# EasyEDA Pro project LeTian-robot2（轮腿机器人）.eprj, board 4010motor-PCB
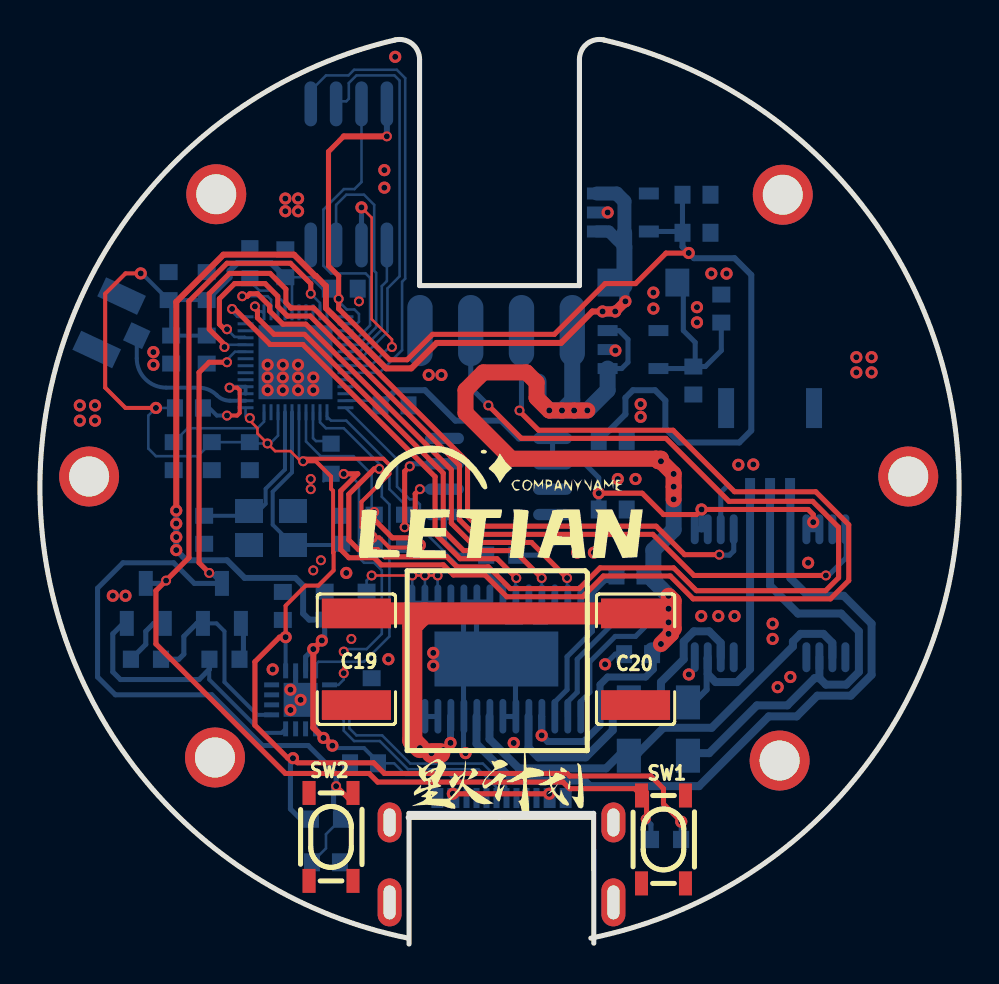
[diagram p10: board, top side]
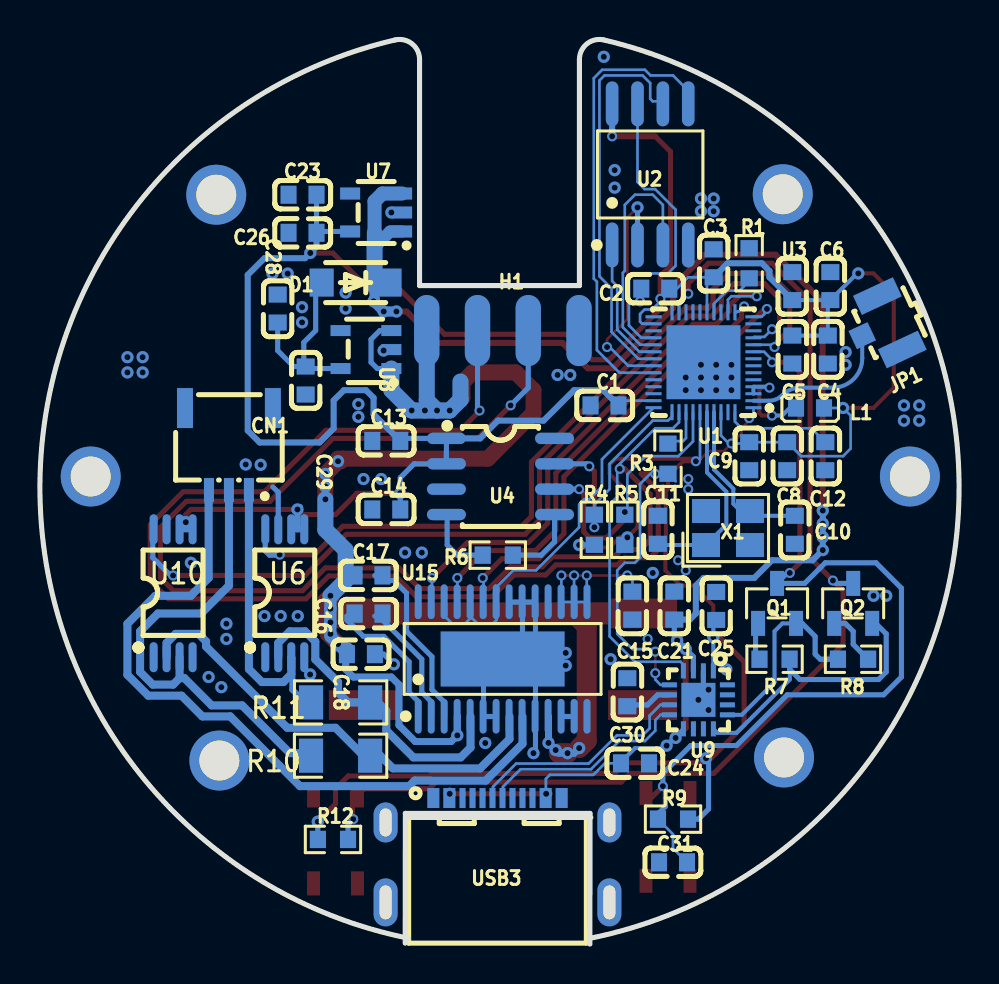
[diagram p11: board, bottom side, seen from below]

Outline 45.99 x 45.23 mm; copper layers: Top Layer, Bottom Layer. Coordinates in mm from the lower left corner of the outline.
Outline path: 18.43,0.29 arc(0,22.5) 17.77,45.23 arc(18.62,45.04) 19,44.26 19,32.94 27,32.94 27,44.26 arc(27.38,45.04) 28.22,45.23 arc(45.99,22.5) 27.57,0.29 ; 18.43,6.33 27.57,6.33
Stack: Top Layer 0.035mm / Dielectric1 1.51mm FR4 er 4.5 / Bottom Layer 0.035mm

## Design rules (mm)
spacing safeClearance (default): track to track 0.152, other pairs 0.152 to 0.3
track width trackWidth (default): min 0.127, default 0.254, max 2.54
differential pair differentialPair (default): width min 0.127, default 0.254, max 2.54; gap min 0.152, default 0.152
via viaSize (default): diameter min 0.5, default 0.61, max 10; hole min 0.3, default 0.305, max 6

## Placement (name value [footprint] x y rotation side)
C1  0.1uF  [C0603]  17.74 26.95 0 bottom
C2  1uF  [C0603]  15.2 32.79 0 bottom
C3  0.1uF  [C0603]  12.28 34.06 270 bottom
C4  0.1uF  [C0603]  6.57 29.74 270 bottom
C5  0.1uF  [C0603]  8.34 29.74 270 bottom
C6  1uF  [C0603]  6.44 32.92 90 bottom
C8  100pF  [C0603]  8.6 24.41 270 bottom
C9  1uF  [C0603]  10.5 24.41 270 bottom
C10  10pF  [C0603]  8.22 20.73 90 bottom
C11  10pF  [C0603]  15.07 20.73 270 bottom
C12  10nF  [C0603]  6.69 24.41 270 bottom
C13  0.1uF  [C0603]  28.66 25.17 180 bottom
C14  1uF  [C0603]  28.66 21.74 180 bottom
C15  0.47uF  [C0603]  16.34 16.93 90 bottom
C16  10nF  [C0603]  29.55 16.53 0 bottom
C17  0.1uF  [C0603]  29.55 18.44 180 bottom
C18  0.1uF  [C0603]  29.93 14.5 0 bottom
C19  47uF  [C1812]  15.84 14.25 90 top
C20  47uF  [C1812]  29.81 14.25 90 top
C21  1uF  [C0603]  14.25 16.93 90 bottom
C23  0.1uF  [C0603]  32.85 37.49 0 bottom
C24  0.1uF  [C0603]  16.22 9.04 180 bottom
C25  0.1uF  [C0603]  12.15 16.92 270 bottom
C26  10uF  [C0603]  32.85 35.58 0 bottom
C28  0.1uF  [C0603]  34.1 31.79 90 bottom
C29  10uF  [C0603]  32.7 28.19 270 bottom
C30  0.1uF  [C0603]  16.6 12.6 270 bottom
C31  0.1uF  [C0603]  14.31 4.09 180 bottom
CN1  HDGC1002WR-S-3P  [CONN-SMD_3P-P1.00_HDGC_HDGC1002WR-S-3P]  36.54 24.76 0 bottom
D1  K24  [SOD-123FL_L2.8-W1.9-LS3.7-RD]  30.2 33.09 0 bottom
H1  -  [排针 4P]  22.83 30.63 180 bottom
JP1  U.FL-R-SMT-1(80)  [RF-SMD_FRF05002-JSS103M]  4.15 30.76 245 bottom
L1  2nH  [L0603]  7.45 26.82 0 bottom
NOREF  -  [Pad_e1]  2.46 23.39 0 top
NOREF#2  -  [Pad_e4]  37.02 9.18 0 top
NOREF#3  -  [Pad_e0]  43.46 23.39 0 top
NOREF#4  -  [Pad_e5]  8.76 9.33 0 top
NOREF#5  -  [Pad_e3]  37.17 37.49 0 top
NOREF#6  -  [Pad_e2]  8.82 37.51 0 top
Q1  SS8050  [SOT-23-3_L2.9-W1.3-P1.90-LS2.4-BR]  9.11 17.04 270 bottom
Q2  SS8050  [SOT-23-3_L2.9-W1.3-P1.90-LS2.4-BR]  5.3 17.04 270 bottom
R1  10k  [R0603]  10.5 34.06 270 bottom
R3  499  [R0603]  14.57 24.28 270 bottom
R4  10k  [R0603]  18.25 20.73 270 bottom
R5  10k  [R0603]  16.73 20.73 270 bottom
R6  1k  [R0603]  23.08 19.46 0 bottom
R7  10K  [R0603]  9.23 14.25 0 bottom
R8  10K  [R0603]  5.3 14.25 180 bottom
R9  10k  [R0603]  14.31 6.25 180 bottom
R10  0.005  [R1206]  30.95 9.42 180 bottom
R11  0.005  [R1206]  30.95 12.09 180 bottom
R12  10k  [R0603]  31.33 5.23 0 bottom
SW1  -  [KEY-SMD_4P-L4.2-W3.2-P2.20-LS5.1-TL]  31.2 5.23 90 top
SW2  -  [KEY-SMD_4P-L4.2-W3.2-P2.20-LS5.1-TL]  14.57 5.36 90 top
U1  -  [QFN-48_L5.0-W5.0-P0.35-BL-EP3.7]  12.79 29.11 90 bottom
U2  W25Q80DVSSIG  [SOIC-8_L5.3-W5.3-P1.27-LS8.0-BL]  15.46 38.51 180 bottom
U3  10uF  [C0603]  8.34 32.92 90 bottom
U4  AS5600-ASOT  [SOIC-8_L5.0-W4.0-P1.27-LS6.0-BL]  22.95 23.39 270 bottom
U6  INA240A3PWR  [TSSOP-8_L4.4-W3.0-P0.65-LS6.4-BL-2]  33.74 17.55 180 bottom
U7  SPX3819M5-L-3-3/TR  [SOT-23-5_L3.0-W1.7-P0.95-LS2.8-BR]  29.17 36.6 180 bottom
U8  SPX3819M5-L-5-0/TR  [SOT-23-5_L3.0-W1.7-P0.95-LS2.8-TL]  29.68 29.74 0 bottom
U9  CH343P  [TQFN-16_L3.0-W3.0-P0.50-BL-EP1.7]  13.04 12.22 0 bottom
U10  INA240A3PWR  [TSSOP-8_L4.4-W3.0-P0.65-LS6.4-BL-2]  39.33 17.55 180 bottom
U15  DRV8313PWPR  [HTSSOP-28_L9.8-W4.5-P0.65-LS6.6-BL-EP]  22.84 14.26 180 bottom
USB3  TYPE-C 16P CB0.8 073  [USB-C-SMD_TYPE-C-16P-CB0.8-073]  23.1 4.69 180 bottom
X1  -  [CRYSTAL-SMD_4P-L3.2-W2.5-BL]  11.56 20.81 180 bottom

## Footprints (pads in the part's own frame, mm; a bottom-side part is the same pattern mirrored in y, then rotated)
C0603
  rect 0.8x0.9 smd: 1(-0.7,0) 2(0.7,0)
C1812
  rect 1.486x3.457 smd: 1(-2.293,0) 2(2.293,0)
CONN-SMD_3P-P1.00_HDGC_HDGC1002WR-S-3P
  rect 0.5x1.2 smd: 1(-1,2.05) 2(0,2.05) 3(1,2.05)
  rect 0.8x2 smd: 4(2.2,-2.05) 5(-2.2,-2.05)
CRYSTAL-SMD_4P-L3.2-W2.5-BL
  rect 1.4x1.2 smd: 1(-1.1,-0.85) 2(1.1,-0.85) 3(1.1,0.85) 4(-1.1,0.85)
HTSSOP-28_L9.8-W4.5-P0.65-LS6.6-BL-EP
  oval 0.343x1.732 smd: 1(-4.224,-2.865) 2(-3.574,-2.865) 3(-2.926,-2.865) 4(-2.276,-2.865) 5(-1.625,-2.865) 6(-0.976,-2.865) 7(-0.325,-2.865) 8(0.325,-2.865) 9(0.976,-2.865) 10(1.625,-2.865) 11(2.276,-2.865) 12(2.926,-2.865) 13(3.576,-2.865) 14(4.224,-2.865) 15(4.224,2.865) 16(3.576,2.865) 17(2.926,2.865) 18(2.276,2.865) 19(1.625,2.865) 20(0.976,2.865) 21(0.325,2.865) 22(-0.325,2.865) 23(-0.976,2.865) 24(-1.625,2.865) 25(-2.276,2.865) 26(-2.926,2.865) 27(-3.574,2.865) 28(-4.224,2.865)
  rect 6.2x2.751 smd: 29(0,0)
KEY-SMD_4P-L4.2-W3.2-P2.20-LS5.1-TL
  rect 1.199x0.65 smd: 1(-2.2,1.1) 2(2.2,1.1) 3(-2.2,-1.1) 4(2.2,-1.1)
L0603
  rect 0.8x0.864 smd: 1(-0.7,0) 2(0.7,0)
Pad_e0
  round 3 hole 2: 1(0,0)
Pad_e1
  round 3 hole 2: 1(0,0)
Pad_e2
  round 3 hole 2: 1(0,0)
Pad_e3
  round 3 hole 2: 1(0,0)
Pad_e4
  round 3 hole 2: 1(0,0)
Pad_e5
  round 3 hole 2: 1(0,0)
QFN-48_L5.0-W5.0-P0.35-BL-EP3.7
  rect 0.15x0.8 smd: 1(-2.275,-2.5) 2(-1.925,-2.5) 3(-1.575,-2.5) 4(-1.225,-2.5) 5(-0.875,-2.5) 6(-0.525,-2.5) 7(-0.175,-2.5) 8(0.175,-2.5) 9(0.525,-2.5) 10(0.875,-2.5) 11(1.225,-2.5) 12(1.575,-2.5) 13(1.925,-2.5) 14(2.275,-2.5) 25(2.275,2.5) 26(1.925,2.5) 27(1.575,2.5) 28(1.225,2.5) 29(0.875,2.5) 30(0.525,2.5) 31(0.175,2.5) 32(-0.175,2.5) 33(-0.525,2.5) 34(-0.875,2.5) 35(-1.225,2.5) 36(-1.575,2.5) 37(-1.925,2.5) 38(-2.275,2.5)
  rect 0.8x0.15 smd: 15(2.5,-1.575) 16(2.5,-1.225) 17(2.5,-0.875) 18(2.5,-0.525) 19(2.5,-0.175) 20(2.5,0.175) 21(2.5,0.525) 22(2.5,0.875) 23(2.5,1.225) 24(2.5,1.575) 39(-2.5,1.575) 40(-2.5,1.225) 41(-2.5,0.875) 42(-2.5,0.525) 43(-2.5,0.175) 44(-2.5,-0.175) 45(-2.5,-0.525) 46(-2.5,-0.875) 47(-2.5,-1.225) 48(-2.5,-1.575)
  rect 3.7x3.7 smd: 49(0.001,0)
R0603
  rect 0.806x0.864 smd: 1(-0.753,0) 2(0.753,0)
R1206
  rect 1.208x1.701 smd: 1(-1.479,0) 2(1.479,0)
RF-SMD_FRF05002-JSS103M
  rect 1x1.05 smd: 1(0,-0.762)
  rect 1.05x2.2 smd: 2(-1.475,0.762) 3(1.475,0.762)
SOD-123FL_L2.8-W1.9-LS3.7-RD
  rect 1.199x1.399 smd: 1(-1.7,0) 2(1.7,0)
SOIC-8_L5.0-W4.0-P1.27-LS6.0-BL
  oval 0.569x1.95 smd: 1(-1.905,-2.705) 2(-0.635,-2.705) 3(0.635,-2.705) 4(1.905,-2.705) 5(1.905,2.705) 6(0.635,2.705) 7(-0.635,2.705) 8(-1.905,2.705)
SOIC-8_L5.3-W5.3-P1.27-LS8.0-BL
  oval 0.63x2.25 smd: 1(-1.905,-3.53) 2(-0.635,-3.53) 3(0.635,-3.53) 4(1.905,-3.53) 5(1.905,3.53) 6(0.635,3.53) 7(-0.635,3.53) 8(-1.905,3.53)
SOT-23-3_L2.9-W1.3-P1.90-LS2.4-BR
  rect 1.25x0.7 smd: 1(1,-0.95) 2(1,0.95) 3(-1,0)
SOT-23-5_L3.0-W1.7-P0.95-LS2.8-BR
  rect 1x0.6 smd: 1(1.3,-0.95) 2(1.3,0) 3(1.3,0.95) 4(-1.3,0.95) 5(-1.3,-0.95)
SOT-23-5_L3.0-W1.7-P0.95-LS2.8-TL
  rect 1x0.55 smd: 1(-1.272,0.95) 2(-1.272,0) 3(-1.272,-0.95) 4(1.272,-0.95) 5(1.272,0.95)
TQFN-16_L3.0-W3.0-P0.50-BL-EP1.7
  rect 0.25x0.75 smd: 1(-0.749,-1.45) 2(-0.248,-1.45) 3(0.252,-1.45) 4(0.751,-1.45) 9(0.75,1.45) 10(0.25,1.45) 11(-0.25,1.45) 12(-0.749,1.45)
  rect 0.75x0.25 smd: 5(1.45,-0.75) 6(1.45,-0.25) 7(1.45,0.25) 8(1.45,0.75) 13(-1.45,0.75) 14(-1.45,0.25) 15(-1.45,-0.25) 16(-1.45,-0.75)
  rect 1.7x1.7 smd: 17(0.001,0)
TSSOP-8_L4.4-W3.0-P0.65-LS6.4-BL-2
  oval 0.4x1.5 smd: 1(-0.975,-3.2) 2(-0.325,-3.2) 3(0.325,-3.2) 4(0.976,-3.2) 5(0.976,3.2) 6(0.325,3.2) 7(-0.325,3.2) 8(-0.975,3.2)
USB-C-SMD_TYPE-C-16P-CB0.8-073
  oval 1.2x2.4 hole 0.6x1.7: 0(-5.6,-2.611) 0(5.6,-2.611)
  oval 1.2x2 hole 0.6x1.4: 0(-5.6,1.389) 0(5.6,1.389)
  rect 0.6x1 smd: A1B12(-3.21,2.611) A4B9(-2.41,2.611) B1A12(3.21,2.611) B4A9(2.41,2.611)
  rect 0.3x1 smd: A5(-1.25,2.611) A6(-0.25,2.611) A7(0.251,2.61) A8(1.25,2.611) B5(1.75,2.611) B6(0.75,2.611) B7(-0.75,2.61) B8(-1.75,2.611)
排针 4P
  oval 1.27x3.561 smd: 1(-3.81,0.064) 2(-1.27,0.064) 3(1.27,0.064) 4(3.81,0.064)

## Nets
3V3: C1.1 C2.1 C3.2 C4.1 C5.1 C6.1 C8.1 C9.1 C13.2 C14.2 C23.1 C25.2 C26.1 L1.1 R4.2 R5.2 R9.2 R12.2 U1.1 U1.19 U1.26 U1.37 U1.43 U1.46 U2.8 U3.1 U4.1 U4.2 U6.5 U6.6 U7.5 U9.1 U10.5 U10.6
5V: C21.1 C24.1 D1.1 U7.1 U7.3 U9.3 U9.9 USB3.A4B9 USB3.B4A9
5V_IN: C28.1 C29.1 D1.2 U8.5
GND: C1.2 C2.2 C3.1 C4.2 C5.2 C6.2 C8.2 C9.2 C10.1 C11.1 C12.2 C13.1 C14.1 C15.1 C18.1 C19.1 C20.1 C21.2 C23.2 C24.2 C25.1 C26.2 C28.2 C29.2 C30.1 C31.1 CN1.4 CN1.5 H1.4 JP1.2 JP1.3 NOREF.1 NOREF#2.1 NOREF#3.1 NOREF#4.1 NOREF#5.1 NOREF#6.1 R1.1 R6.2 SW1.3 SW2.1 U1.49 U2.4 U3.2 U4.4 U4.8 U6.4 U6.7 U7.2 U8.2 U9.2 U9.17 U10.4 U10.7 U15.6 U15.7 U15.10 U15.12 U15.13 U15.14 U15.19 U15.20 U15.21 U15.28 U15.29 USB3.0 USB3.A1B12 USB3.B1A12 X1.2 X1.4
VCC: C17.1 C18.2 C19.2 C20.2 H1.1 U8.1 U8.3 U15.4 U15.11
DTR: Q2.2 R7.1 U9.12
EN: C31.2 Q1.3 R9.1 SW2.4 U1.9
GPIO0: Q2.3 R12.1 SW1.2 U1.23
ISEN_U: U1.10 U6.8
ISEN_V: U1.11 U10.8
M_EN: U1.38 U15.22 U15.24 U15.26
PWM1: U1.16 U15.27
PWM2: U1.15 U15.25
PWM3: U1.14 U15.23
RTS: Q1.2 R8.1 U9.13
RXD: H1.2 R3.2 U9.5
SCK/CLK: U1.31 U2.6
SCL: R4.1 U1.39 U4.7
SCS/CMD: U1.30 U2.1
SDA: R5.1 U1.42 U4.6
SDI/SD1: U1.33 U2.5
SDO/SD0: U1.32 U2.2
SHD/SD2: U1.28 U2.7
SWP/SD3: U1.29 U2.3
TXD: H1.3 U1.40 U9.4
U-I: R11.2 U6.2 U15.5
U-O: CN1.1 R11.1 U6.3
UD+: U9.7 USB3.A6
UD-: U9.8 USB3.A7
V-I: R10.2 U10.2 U15.8
V-O: CN1.2 R10.1 U10.3
W: CN1.3 U15.9
$1N20049: R1.2 U1.18
$1N20884: L1.2 U1.3 U1.4
$1N22670: C10.2 U1.45 X1.3
$1N22706: C11.2 U1.44 X1.1
$1N23281: C12.1 U1.48
$1N23445: R3.1 U1.41
$1N23827: JP1.1 U1.2
$1N25852: R6.1 U4.5
$1N27382: C15.2 U15.15 U15.16 U15.17
$1N28418: C16.2 U15.1
$1N28444: C16.1 U15.2
$1N28632: C17.2 U15.3
$1N46692: C30.2 U9.6
$1N51311: Q2.1 R8.2
$1N51359: Q1.1 R7.2

Pads without a net: SW1 1 4; SW2 2 3; U1 5 6 7 8 12 13 17 20 21 22 24 25 27 34 35 36 47; U4 3; U6 1; U7 4; U8 4; U9 10 11 14 15 16; U10 1; U15 18; USB3 A5 A8 B5 B6 B7 B8

## Via types
v1: diameter 0.61, hole 0.305, Top Layer to Bottom Layer, 111 vias
v2: diameter 0.5, hole 0.3, Top Layer to Bottom Layer, 44 vias

## Routing (per net, layer and track width the routed paths; a pad name or vN(x,y) marks a point on that pad's centre or on a via; arc(x,y) is an arc through that point)
3V3: length 203.4
  Top Layer w0.13: v2(10.5,26.31) 10.5,26.19 10.88,25.81 10.88,25.55 v2(11.39,25.04) 11.77,24.66 12.53,24.66 13.04,24.15
  Top Layer w0.2: v1(5.8,26.82) 4.28,26.82 3.26,27.84 3.26,32.54 4.28,33.55 v1(5.04,33.55) ; v2(13.17,24.15) 13.8,24.15 14.57,23.39 14.57,22.78 14.67,22.67 14.67,19.58 14.69,19.6 14.69,18.69 13.93,17.93 13.3,17.93 12.29,16.93 v1(12.29,15.35) ; v2(13.17,24.15) 13.3,24.28 17.18,24.28 17.49,23.98 17.49,23.52 16.09,22.12 16.09,20.85 v1(16.6,20.34) 16.98,20.34 17.49,19.84 18.88,19.84 v1(19.01,19.96) ; v2(13.17,24.15) 13.04,24.15
  Top Layer w0.254: v1(12.29,15.35) 11.99,15.35 10.76,14.12 10.76,10.95 12.41,9.3 v1(12.66,9.3) 12.89,9.07 16.7,9.07 17.23,8.53 26.38,8.53 26.5,8.41 30.57,8.41 31.2,7.77 31.2,7.01 v1(32.09,6.12) ; 15.2,40.41 14.44,39.65 14.44,33.93 14.95,33.43 v2(14.95,32.28) 14.95,31.79 17.5,29.23 18.38,29.23 19.65,30.5 25.74,30.5 28.28,33.04 29.81,33.04 31.33,34.57 32.46,34.57 v1(32.47,34.58) ; v1(27.96,22.55) 30.14,22.55 31.2,21.49 32.85,21.49 v1(33.11,21.74) 38.44,21.74 38.7,21.49 v1(38.7,21.11)
  Top Layer w0.3: 15.2,40.41 v2(17.36,40.41)
  Bottom Layer w0.13: U1.1 10.29,26.4 10.38,26.31 v2(10.5,26.31) ; 12.53,33.36 C3.2 ; 12.53,33.36 12.61,33.28 U1.19 ; 12.53,33.36 13.55,33.36 14.25,32.66 14.57,32.66 14.82,32.41 14.82,32.28 v2(14.95,32.28) 14.95,32.16 15.36,31.75 15.74,31.75 15.96,31.52 15.96,31.14 15.86,31.03 U1.26 ; U1.46 11.91,25.44 11.52,25.04 10.57,25.04 C9.1 C8.1 7.9,24.41 5.8,24.41 5.42,24.79 5.42,26.44 v1(5.8,26.82) L1.1 ; U1.43 12.96,24.23 13.04,24.15 v2(13.17,24.15) ; U1.37 16.81,27.18 C1.1
  Bottom Layer w0.2: U9.1 v1(12.29,15.35) 12.29,16.08 C25.2 ; 8.47,32.22 U3.1 6.57,32.22 6.57,30.57 6.69,30.44 8.47,30.44 ; C6.1 5.1,33.55 v1(5.04,33.55)
  Bottom Layer w0.254: v1(32.09,6.12) 32.09,5.24 R12.2 ; C13.2 27.84,25.3 U4.1 U4.2 27.27,24.03 27.96,23.33 v1(27.96,22.55) C14.2 ; v1(19.01,19.96) 19,19.97 R4.2 ; U7.5 32.09,35.65 C26.1 C23.1 ; v1(12.66,9.3) 12.53,9.17 12.53,6.76 13.04,6.25 R9.2
  Bottom Layer w0.3: 33.11,20.75 U6.5 ; 33.11,20.75 U6.6 ; 33.11,20.75 v1(33.11,21.74) 32.98,21.87 ; U4.1 23.96,25.3 23.08,26.19 20.79,26.19 19.27,27.71 17.8,27.71 C1.1 ; U10.6 U10.5 ; C26.1 32.15,34.89 v1(32.47,34.58) 32.73,34.31 34.76,34.31 35.6,33.48 35.6,25.69 35,25.09 32,25.09 31.3,25.79 31.3,27.19 30.78,27.71 29.68,27.71 29.3,27.33 29.3,26.51 C13.2 ; U3.1 9.49,33.36 9.49,33.68 9.87,34.06 11.58,34.06 C3.2 ; U2.8 v2(17.36,40.41)
5V: length 82.4
  Top Layer w0.254: v1(25.49,7.52) v1(20.66,7.52)
  Top Layer w0.3: v1(14.63,9.92) 14.25,10.31 v1(14.19,10.31) 13.68,10.82 v1(13.68,14.76) v1(14.11,15.19) ; v1(28.16,31.65) 27.65,31.65 26.08,30.08 19.85,30.08 18.58,28.81 17.32,28.81 14.31,31.81 14.31,32.92 13.8,33.43 13.78,33.43 12.71,34.49 9.18,34.49 6.82,32.13 v1(6.82,21.69)
  Top Layer w0.5: v1(28.16,31.65) v1(28.79,31.65) v1(29.3,32.16)
  Bottom Layer w0.13: C24.1 17.72,9.04 18.3,8.46 20.48,8.46 20.68,8.27 20.68,7.52 ; 20.68,7.52 20.66,7.42 20.68,7.4 20.68,7.52
  Bottom Layer w0.2: U9.9 14.19,10.37 v1(14.19,10.31) 14.25,10.31 14.76,9.8 16.22,9.8 16.92,9.1 C24.1
  Bottom Layer w0.254: U9.3 13.29,14.37 v1(13.68,14.76) 14.25,15.33 14.25,16.23
  Bottom Layer w0.3: v1(6.82,21.69) v1(6.82,21.04) v1(6.82,20.36) v1(6.82,19.71) 7.33,19.2 9.36,19.2 10.24,18.32 12.78,18.32 13.17,17.93 13.17,16.53 13.47,16.23 14.25,16.23
  Bottom Layer w0.5: 29.25,32.11 v1(28.79,31.65) v1(28.16,31.65) ; 29.25,32.11 v1(29.3,32.16) 29.3,32.23 29.25,32.28 ; 29.25,32.11 29.25,32.28 ; 29.25,32.28 29.25,32.92
  Bottom Layer w0.6: 29.25,34.87 28.47,35.65 U7.1
  Bottom Layer w0.7: U7.3 28.86,37.55 29.25,37.16 29.25,35.58
  Bottom Layer w0.77: 29.25,34.87 29.25,35.58
  Bottom Layer w0.8: 29.25,34.87 29.25,32.92
5V_IN: length 9.6
  Bottom Layer w0.254: C28.1 34.1,29.69 33.3,28.89 32.79,28.89 ; 32.79,28.89 C29.1 ; 32.79,28.89 32.79,28.85 32.73,28.79 U8.5 ; 32.79,28.89 32.79,30.1 32.2,30.69 32.2,32.79 D1.2
GND: length 19.4
  Bottom Layer w0.254: U4.4 25.62,21.45 25.62,19.96 25.11,19.46 R6.2 ; 21.85,17.11 21.85,15.22 ; 21.85,17.11 22.5,17.11 ; 21.85,17.11 21.2,17.11 21.2,15.68 ; v1(12.53,12.72) 12.79,12.98 U9.2 ; U6.7 34.07,22.6 34.34,22.87 ; v1(21.3,9.55) 21.2,9.65 21.2,13.13 ; 29.23,14.5 28.79,14.5 v1(28.28,13.99) ; 23.8,13.27 23.8,11.38 23.15,11.38 ; 19.25,11.38 19.9,11.38
  vias: v1(1.99,26.95) v1(1.99,26.19) v1(2.76,26.95) v1(2.76,26.19) v1(3.64,17.42) v1(4.28,17.42) v1(5.68,29.62) v1(5.68,28.98) v1(11.39,28.98) v1(11.39,28.35) v1(11.39,27.71) v1(11.65,13.74) v1(12.15,28.98) v1(12.15,28.35) v1(12.15,27.71) v1(12.28,37.3) v1(12.28,36.66) v1(12.53,11.71) v1(12.92,37.3) v1(12.92,36.66) v1(12.92,28.98) v1(12.92,28.35) v1(12.92,27.71) v1(13.04,12.22) v1(13.68,28.35) v1(13.68,27.71) v1(15.33,18.57) v1(17.23,38.72) v1(17.23,37.84) v1(17.44,14.25) v1(17.78,44.39) v1(19.46,28.47) v1(19.68,14.57) v1(19.68,13.93) v1(20.09,28.47) v1(23.71,10.06) v1(26.89,19.58) v1(27.72,19.58) v1(28.41,36.6) v1(28.8,29.69) v1(28.92,23.27) v1(29.8,23.27) v1(30.06,27.01) v1(30.06,26.38) v1(30.7,32.59) v1(30.7,31.79) v1(32.47,13.49) v1(32.88,31.86) v1(32.88,31.1) v1(33.09,16.41) v1(33.6,33.54) v1(33.95,16.41) v1(34.36,33.54) v1(34.76,16.41) v1(34.95,23.98) v1(35.7,23.99) v1(36.66,16.03) v1(36.66,15.26) v1(36.92,12.85) v1(37.55,13.36) v1(38.44,19.07) v1(40.86,29.36) v1(40.86,28.6) v1(41.62,29.36) v1(41.62,28.6) v2(13.55,23.27) v2(13.55,22.76) v2(13.68,18.69) v2(14.06,19.2) v2(15.58,15.26) v2(15.96,32.16)
VCC: length 83.3
  Top Layer w0.35: v1(20.55,10.06) 20.03,9.55
  Top Layer w0.8: 30.82,24.28 30.95,24.15 31.08,24.28 30.82,24.28 ; 30.82,24.28 23.58,24.28 21.3,26.57 21.3,27.71 22.19,28.6 24.35,28.6 24.85,28.09 24.85,27.33 v1(25.49,26.69) v1(26.12,26.69) v1(26.73,26.69) v1(27.39,26.69) ; v1(31.46,17.42) 31.71,17.17 31.71,15.77 31.58,15.65 31.58,15.52 v1(31.08,15.01) ; v1(31.71,22.25) v1(31.71,22.88) v1(31.71,23.52) v1(31.08,24.15)
  Top Layer w1: 20.03,9.55 v1(19.59,9.55) ; v1(19.01,9.8) 18.63,10.18 18.63,15.91 19.27,16.54
  Top Layer w1.1: C20.2 C19.2
  Bottom Layer w0.254: U8.3 28.98,30.69 29.43,30.25 29.43,29.11 29.11,28.79 U8.1
  Bottom Layer w0.35: v1(19.01,9.8) 19.27,9.55 v1(19.59,9.55) 20.03,9.55 v1(20.55,10.06) 20.55,11.38 ; C18.2 30.7,14.44 30.7,13.74 30.31,13.36 28.41,13.36 28.03,12.98 28.03,10.95 27.21,10.13 25.42,10.13 v1(25.11,10.44) 25.11,11.37 25.1,11.38
  Bottom Layer w0.6: 30.63,14.69 30.76,14.69 v1(31.08,15.01) 31.46,15.39 v1(31.46,16.09) v1(31.46,16.78) v1(31.46,17.42)
  Bottom Layer w0.8: U8.1 28.41,27.71 v1(27.39,26.69) v1(26.73,26.69) v1(26.12,26.69) ; 30.63,14.69 C18.2 ; v1(31.71,22.25) 31.71,20.73 30.7,19.71 30.7,18.5 ; 30.7,18.5 30.63,18.44 ; 30.7,18.5 30.7,18.19 v1(31.46,17.42) ; v1(26.12,26.69) 26.64,27.21 H1.1 ; v1(26.12,26.69) v1(25.49,26.69) 24.95,27.23 24.95,28.14
  vias: v1(20.19,9.7) v1(31.46,15.52)
DTR: length 14.1
  Bottom Layer w0.2: 8.47,13.74 8.47,13.23 11.14,10.57 12.09,10.57 12.29,10.77 ; 8.47,14.24 R7.1
  Bottom Layer w0.254: R7.1 8.48,13.75 7.96,13.23 4.03,13.23 3.64,13.61 3.64,15.52 4.17,16.04 Q2.2
EN: length 46
  Top Layer w0.254: v2(9.36,29.11) 8.47,29.11 7.96,28.6 7.96,19.07 v2(8.47,18.57) ; v2(14.82,7.9) 15.42,7.3 15.67,7.3
  Bottom Layer w0.13: v2(9.36,29.11) 9.36,29.23 9.76,29.63 U1.9 ; C31.2 14.31,4.79 14.31,5.49 R9.1
  Bottom Layer w0.254: 9.12,18.04 7.72,18.04 6.69,19.07 4.15,19.07 2.88,17.8 2.88,13.36 3.77,12.47 8.6,12.47 11.14,9.93 13.42,9.93 14.82,8.53 v2(14.82,7.9) 14.69,7.77 14.69,6.88 15.07,6.51 R9.1 ; 9.12,18.04 9.23,18.04 ; 9.12,18.04 8.6,18.57 v2(8.47,18.57)
GPIO0: length 57.8
  Top Layer w0.254: v2(13.55,32.54) 13.55,33.04 12.53,34.06 9.36,34.06 7.45,32.16 7.45,19.33 v2(6.31,18.19) 5.8,17.68 5.8,15.01 12.28,8.53 16.47,8.53 16.9,8.1 26.17,8.1 26.5,7.77 29.76,7.77 SW1.2 ; v2(30.31,6.25) 30.36,6.29 30.36,7.6
  Bottom Layer w0.13: U1.23 14.01,32.07 v2(13.55,32.54)
  Bottom Layer w0.254: v2(30.31,6.25) 30.58,5.99 R12.1 ; Q2.3 6.17,18.04 v2(6.31,18.19)
ISEN_U: length 39.9
  Top Layer w0.254: 12.55,31.83 13.69,31.83 21.4,24.12 21.4,21.39 21.89,20.9 30.84,20.9 32.26,19.48 v2(34,19.48) ; 12.55,31.83 12.53,31.84 ; 12.55,31.83 12.53,31.84 ; 12.53,31.87 12.53,31.84 ; 12.53,31.84 12.31,32.1 12.31,32.77 11.52,33.55 9.49,33.55 8.47,32.54 8.47,30.76 9.23,30 v2(9.23,29.87)
  Bottom Layer w0.13: v2(9.23,29.87) 9.23,29.97 9.25,29.98 U1.10
  Bottom Layer w0.254: U6.8 34.72,19.67 34.51,19.46 34.02,19.46 v2(34,19.48)
ISEN_V: length 44.3
  Top Layer w0.254: v2(9.36,30.76) 9.23,30.76 8.98,31.01 8.98,32.28 9.74,33.04 11.26,33.04 11.9,32.41 11.9,31.9 12.38,31.42 13.53,31.42 20.99,23.95 20.99,21.22 21.72,20.5 30.67,20.5 32.73,18.44 v2(39.33,18.44)
  Bottom Layer w0.13: U1.11 10.24,30.38 9.74,30.38 v2(9.36,30.76)
  Bottom Layer w0.254: U10.8 40.35,20.71 40.35,19.33 39.46,18.44 v2(39.33,18.44)
M_EN: length 19.3
  Bottom Layer w0.13: 25.75,17.11 25.75,16.41 25.36,16.03 24.73,16.03 24.45,16.31 24.45,16.38 ; 24.45,17.11 24.45,16.38 ; 24.45,16.38 24.09,16.03 23.33,16.03 23.15,16.21 23.15,17.86 22.31,18.69 21.17,18.69 19.01,20.85 19.01,22 18.76,22.25 18.5,22.25 17.87,22.88 17.87,24.25 U1.38
PWM1: length 27.3
  Top Layer w0.254: v2(26.38,18.31) 24.6,20.09 21.55,20.09 20.59,21.06 20.59,23.73 13.3,31.01 12.15,31.01 11.49,31.67 11.49,31.93 10.88,32.54 10.5,32.54 10.38,32.41 v2(10.12,32.41)
  Bottom Layer w0.13: U1.16 11.56,32.24 11.39,32.41 v2(10.12,32.41) ; v2(26.38,18.31) 26.38,17.13 26.4,17.11
PWM2: length 23.6
  Top Layer w0.254: v2(25.11,18.31) 23.74,19.68 21.2,19.68 20.18,20.7 20.18,23.56 13.24,30.5 11.71,30.5 10.88,31.33 10.88,31.68 10.79,31.77
  Bottom Layer w0.13: U1.15 11.14,31.61 11.1,31.65 11.01,31.65 v2(10.76,31.9) ; 25.1,17.11 25.11,17.12 v2(25.11,18.31)
PWM3: length 23.8
  Top Layer w0.254: v2(23.84,18.31) 22.87,19.28 21.03,19.28 19.77,20.53 19.77,23.38 13.16,30 11.52,30 9.74,31.78 v2(9.61,31.77)
  Bottom Layer w0.13: 23.8,18.31 23.84,18.36 23.8,18.4 23.8,18.31 ; 23.8,18.31 23.8,17.11 ; U1.14 10.28,31.39 9.87,31.39 9.74,31.52 9.74,31.65 v2(9.61,31.77)
RTS: length 10.2
  Bottom Layer w0.2: U9.13 10.87,11.47 9.23,13.11 9.23,15.65 8.84,16.04 8.28,16.04
  Bottom Layer w0.254: 8.28,16.04 7.85,16.04 7.2,15.39 7.2,14.5 6.95,14.25 R8.1
RXD: length 73.2
  Top Layer w0.13: v2(15.2,13.55) v2(15.2,14.63) 15.2,14.78
  Top Layer w0.254: v2(15.2,23.52) 15.21,23.53 15.91,23.53 15.05,22.67 15.05,19.74 15.46,19.33 16.73,19.33 17.09,18.97 20.19,18.97 20.69,18.47 22.27,18.47 23.36,17.38 27.16,17.38 28.2,18.41 31.54,18.41 32.69,17.27 39.56,17.27 40.47,18.19 40.47,20.98 38.82,22.63 34.76,22.63 31.69,25.7 24.96,25.7 24,26.66
  Bottom Layer w0.13: U9.5 14.94,12.97 15.2,13.23 15.2,13.49 ; v2(15.2,23.52) 15.46,23.52 15.96,23.01 15.96,19.33 16.22,19.07 16.73,19.07 17.11,18.69 17.11,15.52 16.34,14.76 15.33,14.76 v2(15.2,14.63) ; 14.19,23.15 R3.2
  Bottom Layer w0.254: v2(24,26.69) 24.1,26.79 24.1,30.69 ; v2(15.2,23.52) 15.19,23.53 R3.2
SCK/CLK: length 19.8
  Bottom Layer w0.13: U2.6 14.95,42.16 15.33,42.16 15.46,42.29 15.46,43.08 15.84,43.46 17.74,43.46 18,43.2 18,33.41 17.39,32.8 17.39,30.62 16.05,29.28 U1.31
SCL: length 12.8
  Top Layer w0.254: v2(18.25,20.85) 18.25,23.65 v2(18.5,23.9)
  Bottom Layer w0.13: 14.36,26.61 14.36,26.39 14.57,26.19 15.33,26.19 17.49,24.03 17.49,22.76 18.25,22 R4.1 v2(18.25,20.85)
  Bottom Layer w0.254: v2(18.5,23.9) 18.63,24.03 20.24,24.03
SCS/CMD: length 6.6
  Bottom Layer w0.13: U2.1 17.36,33.17 17.11,32.92 17.11,30.74 16,29.63 U1.30
SDA: length 13.9
  Top Layer w0.254: v2(16.73,21.61) 16.73,21.23 17.64,20.32 18.48,20.32 18.78,20.62 18.78,22.53 v2(19.01,22.76)
  Bottom Layer w0.13: v2(16.73,21.61) R5.1 ; 16.6,21.61 16.6,23.5 15.69,24.41 14.05,24.41 13.31,25.15 U1.42
  Bottom Layer w0.254: 20.24,22.76 v2(19.01,22.76)
SDI/SD1: length 23
  Bottom Layer w0.13: U1.33 16.99,28.58 18.12,29.72 18.12,33.14 18.28,33.29 18.28,43.32 17.86,43.74 15.72,43.74 15.44,43.46 14.31,43.46 13.55,42.7 U2.5
SDO/SD0: length 12.6
  Top Layer w0.13: v1(16.09,36.85) 16.6,36.35 16.6,31.27 17.61,30.25 v2(17.61,29.87)
  Bottom Layer w0.13: U1.32 16.55,28.93 17.49,29.87 v2(17.61,29.87)
  Bottom Layer w0.254: v1(16.09,36.85) 16.09,34.59
SHD/SD2: length 15.6
  Bottom Layer w0.13: U1.28 15.9,30.33 16.52,30.95 16.52,33.33 16.3,33.55 14.57,33.55 14.19,33.93 14.19,36.75 15.21,37.77 15.74,37.77 16.09,38.12 U2.7
SWP/SD3: length 12.4
  Bottom Layer w0.13: U2.3 14.82,36.98 15.33,37.49 16.22,37.49 16.73,36.98 16.73,33.68 16.82,33.58 16.82,30.86 15.95,29.98 U1.29
TXD: length 75.7
  Top Layer w0.254: v2(22.44,26.95) 24.09,25.3 31.33,25.3 34.48,22.15 38.67,22.15 39.97,20.85 39.97,18.33 39.32,17.68 32.85,17.68 31.71,18.82 28.03,18.82 26.99,17.78 23.53,17.78 22.44,18.87 20.86,18.87 20.36,19.38 17.25,19.38 16.89,19.74 15.94,19.74 15.46,20.22 15.46,22.5 16.73,23.77 v2(16.98,23.77)
  Bottom Layer w0.13: 17.11,23.9 17.11,22.38 17.49,22 17.49,15.39 16.22,14.12 13.93,14.12 13.79,13.98 U9.4 ; 17.11,23.9 v2(16.98,23.77) ; 17.11,23.9 15.2,25.81 14.31,25.81 14.01,26.1 U1.40
  Bottom Layer w0.254: H1.3 21.56,27.83 v2(22.44,26.95)
U-I: length 16.3
  Bottom Layer w0.4: U6.2 34.07,15.07 33.49,15.65 32.73,15.65 32.22,15.13 32.22,14.24 31.08,13.11 31.08,12.6 30.57,12.09 29.09,12.09 28.66,11.66 28.66,10.69 27.31,9.34 24.94,9.34 24.45,9.83 24.45,11.38
U-O: length 15.6
  Bottom Layer w0.3: 32.05,12.09 32.73,12.09 33.36,12.72 33.36,14.29 U6.3
  Bottom Layer w0.4: CN1.1 35.54,13.76 34.89,13.11 33.81,13.11 33.42,13.5 U6.3
UD+: length 11.1
  Bottom Layer w0.13: U9.7 14.94,11.97 15.48,11.43 15.48,10.79 15.84,10.44 17.12,10.44 18.54,9.03 22.16,9.03 23.32,7.87 23.32,7.67
UD-: length 10.3
  Bottom Layer w0.13: U9.8 14.94,11.47 15.2,11.2 15.2,10.67 15.72,10.16 17.01,10.16 18.42,8.75 21.95,8.75 22.83,7.86 22.83,7.67
V-I: length 22.7
  Bottom Layer w0.4: 22.5,11.38 22.5,10.26 23.96,8.79 28.33,8.79 29.09,9.55 29.93,9.55 31.2,10.82 33.62,10.82 37.68,14.88 37.68,15.14 38.06,15.52 39.2,15.52 39.66,15.07 U10.2
V-O: length 24.1
  Bottom Layer w0.4: 32.05,9.55 33.49,9.55 35.88,11.94 37.4,11.94 38.77,13.3 39.01,13.3 ; 39.01,13.3 U10.3 ; 39.01,13.3 39.33,12.98 40.35,12.98 40.98,13.61 40.98,15.65 40.09,16.53 37.93,16.53 36.54,17.93 CN1.2
W: length 36.3
  Bottom Layer w0.4: CN1.3 37.55,22.73 37.55,18.31 38.44,17.42 40.22,17.42 41.62,16.03 41.62,13.47 40.58,12.43 38.91,12.43 37.87,11.39 36.47,11.39 32.98,7.9 27.52,7.9 27.24,8.18 23.69,8.18 21.85,10.02 21.85,11.38
$1N20049: length 2.7
  Bottom Layer w0.13: U1.18 12.26,32.04 11.61,32.69 10.98,32.69 10.76,32.92 10.76,33.31
$1N20884: length 4.9
  Top Layer w0.2: v2(9.36,26.44) 9.87,26.44 9.99,26.57 9.99,27.71 9.87,27.84 v2(9.49,27.84)
  Bottom Layer w0.2: L1.2 8.47,26.82 8.85,26.44 v2(9.36,26.44) ; v2(9.49,27.84) 9.61,27.84 9.66,27.88 U1.4 10.29,27.54
$1N22670: length 8.3
  Bottom Layer w0.2: C10.2 10.22,21.43 X1.3 10.93,21.66 11.29,22.02 11.29,22.78 12.26,23.74 12.26,26.61
$1N22706: length 9.9
  Bottom Layer w0.2: U1.44 12.61,23.6 11.65,22.63 11.65,20.98 X1.1 15.01,19.96 C11.2
$1N23281: length 5.4
  Bottom Layer w0.13: C12.1 7.39,25.81 10.88,25.81 11.21,26.14 U1.48
$1N23445: length 2.3
  Bottom Layer w0.13: 14.57,25.16 13.81,25.16 13.66,25.31 U1.41
$1N23827: length 7.6
  Bottom Layer w0.2: JP1.1 4.84,29.31 arc(5.27,28.27) 6.31,27.84 7.93,27.84 arc(8.43,27.74) 8.85,27.46 arc(9.16,27.25) 9.51,27.18 U1.2
$1N25852: length 3.7
  Bottom Layer w0.254: R6.1 20.92,19.46 20.24,20.13 20.24,21.49
$1N27382: length 9.5
  Top Layer w0.13: v2(16.6,18.44) v2(18.63,18.44) v2(19.27,18.44) v2(19.9,18.44)
  Bottom Layer w0.13: v2(18.63,18.44) 18.63,17.11 19.27,17.11 ; 19.27,17.11 19.9,17.11 ; 19.27,17.11 v2(19.27,18.44) ; 19.9,17.11 19.9,17.12 v2(19.9,18.44) ; 19.9,17.11 19.9,17.11 ; C15.2 16.34,18.19 v2(16.6,18.44)
$1N28418: length 7.1
  Bottom Layer w0.254: 27.05,11.38 27.05,12.12 27.52,12.6 27.52,14.12 28.79,15.39 29.81,15.39 30.63,16.22 30.63,16.41
$1N28444: length 6.3
  Bottom Layer w0.254: 29.23,16.41 29.04,16.41 26.89,14.25 26.89,12.6 26.4,12.11 26.4,11.38
$1N28632: length 8.9
  Bottom Layer w0.254: 25.75,11.38 25.75,12.09 26.38,12.72 26.38,14.38 27.65,15.65 27.65,17.55 28.28,18.19 28.98,18.19 29.23,18.44
$1N46692: length 2.3
  Bottom Layer w0.254: U9.6 15.08,12.47 15.58,11.96 16.53,11.96 C30.2
$1N51311: length 2.8
  Bottom Layer w0.254: Q2.1 5.69,16.04 5.3,15.65 5.3,14.99 R8.2
$1N51359: length 1.9
  Bottom Layer w0.254: 10.18,16.04 10.18,14.45 R7.2

## Copper pours and planes (outline as drawn; the poured copper is in the pictures)
GND on Top Layer: 47.76,23.99 47.72,24.96 47.64,25.93 47.53,26.9 47.38,27.86 47.19,28.82 46.96,29.76 46.69,30.7 46.39,31.63 46.06,32.54 45.68,33.44 45.28,34.33 44.83,35.2 44.36,36.05 43.85,36.88 43.31,37.69 42.73,38.48 42.13,39.24 41.5,39.98 40.84,40.7 40.15,41.39 39.43,42.05 38.69,42.68 37.93,43.28 37.14,43.86 36.33,44.4 35.5,44.91 34.65,45.38 33.78,45.82 32.89,46.23 31.99,46.61 31.08,46.94 30.15,47.24 29.22,47.51 28.27,47.74 27.31,47.93 26.35,48.08 25.38,48.19 24.41,48.27 23.44,48.31 22.46,48.31 21.49,48.27 20.52,48.19 19.55,48.08 18.59,47.93 17.63,47.74 16.69,47.51 15.75,47.24 14.82,46.94 13.91,46.61 13.01,46.23 12.12,45.82 11.25,45.38 10.4,44.91 9.57,44.4 8.76,43.86 7.98,43.28 7.21,42.68 6.47,42.05 5.75,41.39 5.07,40.7 4.4,39.98 3.77,39.24 3.17,38.48 2.6,37.69 2.05,36.88 1.54,36.05 1.07,35.2 0.63,34.33 0.22,33.44 -0.15,32.54 -0.49,31.63 -0.79,30.7 -1.06,29.76 -1.28,28.82 -1.47,27.86 -1.63,26.9 -1.74,25.93 -1.82,24.96 -1.86,23.99 -1.86,23.01 -1.82,22.04 -1.74,21.07 -1.63,20.1 -1.47,19.14 -1.28,18.18 -1.06,17.24 -0.79,16.3 -0.49,15.37 -0.15,14.46 0.22,13.56 0.63,12.67 1.07,11.8 1.54,10.95 2.05,10.12 2.6,9.31 3.17,8.52 3.77,7.76 4.4,7.02 5.07,6.3 5.75,5.61 6.47,4.95 7.21,4.32 7.98,3.72 8.76,3.14 9.57,2.6 10.4,2.09 11.25,1.62 12.12,1.18 13.01,0.77 13.91,0.39 14.82,0.06 15.75,-0.24 16.69,-0.51 17.63,-0.74 18.59,-0.93 19.55,-1.08 20.52,-1.19 21.49,-1.27 22.46,-1.31 23.44,-1.31 24.41,-1.27 25.38,-1.19 26.35,-1.08 27.31,-0.93 28.27,-0.74 29.22,-0.51 30.15,-0.24 31.08,0.06 31.99,0.39 32.89,0.77 33.78,1.18 34.65,1.62 35.5,2.09 36.33,2.6 37.14,3.14 37.93,3.72 38.69,4.32 39.43,4.95 40.15,5.61 40.84,6.3 41.5,7.02 42.13,7.76 42.73,8.52 43.31,9.31 43.85,10.12 44.36,10.95 44.83,11.8 45.28,12.67 45.68,13.56 46.06,14.46 46.39,15.37 46.69,16.3 46.96,17.24 47.19,18.18 47.38,19.14 47.53,20.1 47.64,21.07 47.72,22.04 47.76,23.01
GND on Bottom Layer: 46.91,23.97 46.88,24.91 46.8,25.85 46.69,26.78 46.54,27.71 46.36,28.64 46.14,29.55 45.89,30.46 45.59,31.35 45.27,32.23 44.91,33.1 44.51,33.96 44.09,34.8 43.63,35.62 43.14,36.42 42.61,37.2 42.06,37.96 41.48,38.7 40.87,39.42 40.23,40.11 39.56,40.78 38.87,41.41 38.15,42.03 37.42,42.61 36.65,43.16 35.87,43.68 35.07,44.18 34.25,44.64 33.41,45.06 32.56,45.46 31.69,45.82 30.8,46.14 29.91,46.43 29,46.69 28.09,46.91 27.16,47.09 26.23,47.24 25.3,47.35 24.36,47.42 23.42,47.46 22.48,47.46 21.54,47.42 20.6,47.35 19.67,47.24 18.74,47.09 17.81,46.91 16.9,46.69 15.99,46.43 15.1,46.14 14.22,45.82 13.35,45.46 12.49,45.06 11.65,44.64 10.83,44.18 10.03,43.68 9.25,43.16 8.49,42.61 7.75,42.03 7.03,41.41 6.34,40.78 5.68,40.11 5.04,39.42 4.43,38.7 3.84,37.96 3.29,37.2 2.77,36.42 2.27,35.62 1.81,34.8 1.39,33.96 0.99,33.1 0.63,32.23 0.31,31.35 0.02,30.46 -0.24,29.55 -0.46,28.64 -0.64,27.71 -0.79,26.78 -0.9,25.85 -0.97,24.91 -1.01,23.97 -1.01,23.03 -0.97,22.09 -0.9,21.15 -0.79,20.22 -0.64,19.29 -0.46,18.36 -0.24,17.45 0.02,16.54 0.31,15.65 0.63,14.77 0.99,13.9 1.39,13.04 1.81,12.2 2.27,11.38 2.77,10.58 3.29,9.8 3.84,9.04 4.43,8.3 5.04,7.58 5.68,6.89 6.34,6.22 7.03,5.59 7.75,4.97 8.49,4.39 9.25,3.84 10.03,3.32 10.83,2.82 11.65,2.36 12.49,1.94 13.35,1.54 14.22,1.18 15.1,0.86 15.99,0.57 16.9,0.31 17.81,0.09 18.74,-0.09 19.67,-0.24 20.6,-0.35 21.54,-0.42 22.48,-0.46 23.42,-0.46 24.36,-0.42 25.3,-0.35 26.23,-0.24 27.16,-0.09 28.09,0.09 29,0.31 29.91,0.57 30.8,0.86 31.69,1.18 32.56,1.54 33.41,1.94 34.25,2.36 35.07,2.82 35.87,3.32 36.65,3.84 37.42,4.39 38.15,4.97 38.87,5.59 39.56,6.22 40.23,6.89 40.87,7.58 41.48,8.3 42.06,9.04 42.61,9.8 43.14,10.58 43.63,11.38 44.09,12.2 44.51,13.04 44.91,13.9 45.27,14.77 45.59,15.65 45.89,16.54 46.14,17.45 46.36,18.36 46.54,19.29 46.69,20.22 46.8,21.15 46.88,22.09 46.91,23.03
